# Altium schematic sheet connectors.SchDoc: connectors
size A4; SheetNumber: 2; SheetTotal: 11
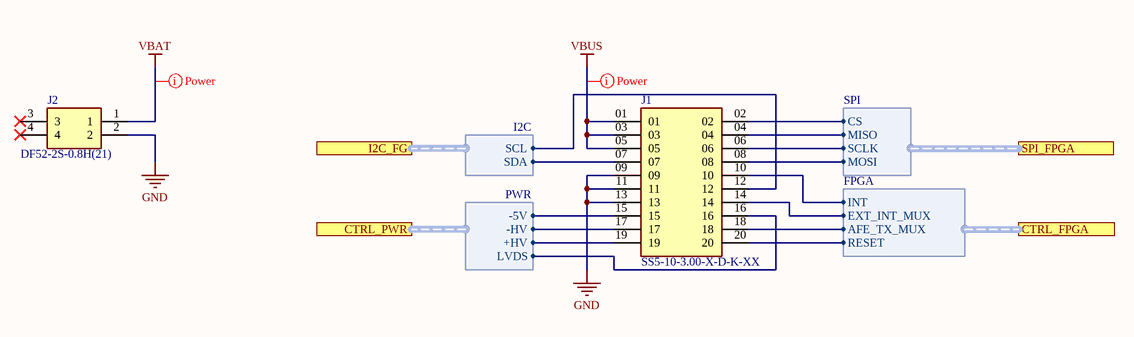
[diagram p0: connectors.SchDoc]

## Parts
J1  SS5-10-3.00-X-D-K-XX  [SAMTEC_SS5-10-3.00-X-D-K-XX]
J2  DF52-2S-0.8H(21)  [DF522S08H21]

## Ports
CTRL_FPGA (harness FPGA, see main[3B], power_io[5A]), CTRL_PWR (harness PWR, see main[3B], power_io[5A]), I2C_FG (harness I2C, see main[3B], io_b[4B], power_conversion[1A], power_io[6C]), SPI_FPGA (harness SPI, see main[3B], io_a[4C], power_io[6B])

## Harnesses
PWR: -5V, -HV, +HV, LVDS
FPGA: INT, EXT_INT_MUX, AFE_TX_MUX, RESET
SPI: CS, MISO, SCLK, MOSI
I2C: SCL, SDA

## Nets
GND: J1.09 J1.11 J1.13 J2.2
VBAT: J2.1
VBUS: J1.01 J1.03 J1.05
NetJ1_02: J1.02 ; port SPI_FPGA.CS
NetJ1_04: J1.04 ; port SPI_FPGA.MISO
NetJ1_06: J1.06 ; port SPI_FPGA.SCLK
NetJ1_07: J1.07 ; port I2C_FG.SDA
NetJ1_08: J1.08 ; port SPI_FPGA.MOSI
NetJ1_10: J1.10 ; port CTRL_FPGA.INT
NetJ1_12: J1.12 ; port I2C_FG.SCL
NetJ1_14: J1.14 ; port CTRL_FPGA.EXT_INT_MUX
NetJ1_15: J1.15 ; port CTRL_PWR.-5V
NetJ1_16: J1.16 ; port CTRL_PWR.LVDS
NetJ1_17: J1.17 ; port CTRL_PWR.-HV
NetJ1_18: J1.18 ; port CTRL_FPGA.AFE_TX_MUX
NetJ1_19: J1.19 ; port CTRL_PWR.+HV
NetJ1_20: J1.20 ; port CTRL_FPGA.RESET

Not connected (* = marked no-connect by the designer): J2 3* 4*

## Layout directives
net class Power: VBAT, VBUS

## Notes on the sheet
- Project:
- Laboratory:
- Date:
- File:
- Rev:
- Variation:
- Drawn By:
- Checked By:
- Sheet:
- /

## Library data of the parts
J1 = SS5-10-3.00-X-D-K-XX: 0.50mm Socket Strip Assembly; MF: Samtec Inc.; Availability: Unavailable; MP: SS5-10-3.00-X-D-K-XX; Price: None; Package: None; Value: *
J2 = DF52-2S-0.8H_21_: Connector; Manufacturer_Name: Hirose; Datasheet Link: https://datasheet.datasheetarchive.com/originals/distributors/DKDS-30/591726.pdf; Height: 1mm; Manufacturer_Part_Number: DF52-2S-0.8H(21); Mouser Part Number: 798-DF52-2S-0.8H21; Mouser Price/Stock: https://www.mouser.co.uk/ProductDetail/Hirose-Connector/DF52-2S-0.8H21?qs=%2FKR40Cd6GUpAHUMGMtWbig%3D%3D